# Altium schematic sheet Power.SchDoc
size A4; SheetNumber: 1; SheetTotal: 2
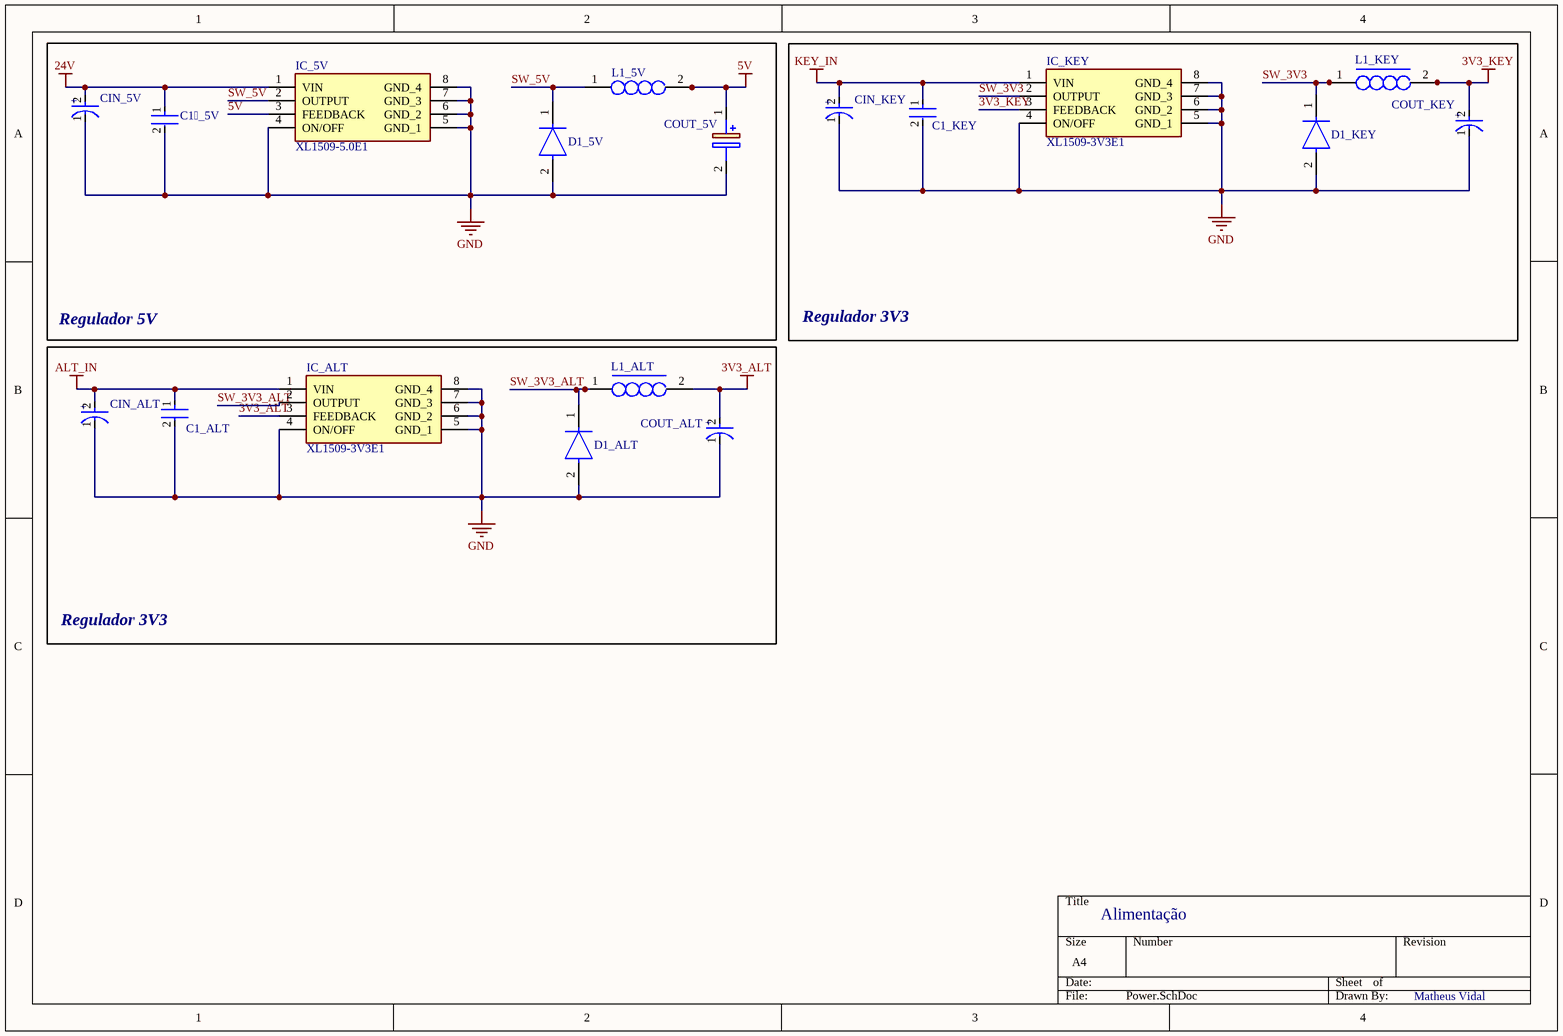
[diagram p0: Power.SchDoc]

## Parts
C1__5V  08055C105KAT2A  [FP-0805-L_2_01_0_2-W_1_25-MFG]  (value not drawn)
C1_ALT  08055C105KAT2A  [FP-0805-L_2_01_0_2-W_1_25-MFG]  (value not drawn)
C1_KEY  08055C105KAT2A  [FP-0805-L_2_01_0_2-W_1_25-MFG]  (value not drawn)
CIN_5V  EEEFK1V471SP  [FP-FKSG-MFG]  (value not drawn)
CIN_ALT  EEEFK1V471SP  [FP-FKSG-MFG]  (value not drawn)
CIN_KEY  EEEFK1V471SP  [FP-FKSG-MFG]  (value not drawn)
COUT_5V  B40900B7277M000  [CAPAE1030X1050N]  (value not drawn)
COUT_ALT  MAL215099001E3  [FP-MAL2150-1010-MFG]  (value not drawn)
COUT_KEY  MAL215099001E3  [FP-MAL2150-1010-MFG]  (value not drawn)
D1_5V  1N5819HW1-7-F  [FP-SOD123F_Type_B-MFG]  (value not drawn)
D1_ALT  1N5819HW1-7-F  [FP-SOD123F_Type_B-MFG]  (value not drawn)
D1_KEY  1N5819HW1-7-F  [FP-SOD123F_Type_B-MFG]  (value not drawn)
IC_5V  XL1509-5.0E1  [SOIC127P600X175-8N]
IC_ALT  XL1509-3V3E1  [SOIC127P600X175-8N]
IC_KEY  XL1509-3V3E1  [SOIC127P600X175-8N]
L1_5V  SRR1260-680M  [INDPM125125X650N]  (value not drawn)
L1_ALT  SPM6545VT-470M-D  [SPM6545VT]  (value not drawn)
L1_KEY  SPM6545VT-470M-D  [SPM6545VT]  (value not drawn)

## Blocks framed on the sheet
Regulador 5V: C1__5V CIN_5V COUT_5V D1_5V IC_5V L1_5V
Regulador 3V3: C1_KEY CIN_KEY COUT_KEY D1_KEY IC_KEY L1_KEY

## Nets
3V3_ALT: COUT_ALT.2(A) IC_ALT.3(FEEDBACK) L1_ALT.2
3V3_KEY: COUT_KEY.2(A) IC_KEY.3(FEEDBACK) L1_KEY.2
5V: COUT_5V.1(+) IC_5V.3(FEEDBACK) L1_5V.2
24V: C1__5V.1 CIN_5V.2(A) IC_5V.1(VIN)
ALT_IN: C1_ALT.1 CIN_ALT.2(A) IC_ALT.1(VIN)
GND: C1__5V.2 C1_ALT.2 C1_KEY.2 CIN_5V.1(C) CIN_ALT.1(C) CIN_KEY.1(C) COUT_5V.2(-) COUT_ALT.1(C) COUT_KEY.1(C) D1_5V.2(A) D1_ALT.2(A) D1_KEY.2(A) IC_5V.4(ON/OFF) IC_5V.5(GND_1) IC_5V.6(GND_2) IC_5V.7(GND_3) IC_5V.8(GND_4) IC_ALT.4(ON/OFF) IC_ALT.5(GND_1) IC_ALT.6(GND_2) IC_ALT.7(GND_3) IC_ALT.8(GND_4) IC_KEY.4(ON/OFF) IC_KEY.5(GND_1) IC_KEY.6(GND_2) IC_KEY.7(GND_3) IC_KEY.8(GND_4)
KEY_IN: C1_KEY.1 CIN_KEY.2(A) IC_KEY.1(VIN)
SW_3V3: D1_KEY.1(C) IC_KEY.2(OUTPUT) L1_KEY.1
SW_3V3_ALT: D1_ALT.1(C) IC_ALT.2(OUTPUT) L1_ALT.1
SW_5V: D1_5V.1(C) IC_5V.2(OUTPUT) L1_5V.1

## Notes on the sheet
- Regulador 3V3
- Alimentação
- Matheus Vidal
- (in symbol CMP-00030-44434444-1) +
- (in symbol CMP-05427-000037-1) +

## Library data of the parts
C1__5V C1_ALT C1_KEY = CMP-2007-04696-2: General Purpose Ceramic Capacitor, 0805, 1uF, 10%, X7R, 15%, 50V; Dissipation Factor: 2.5%; Packaging: Tape and Reel; Lead Free: Lead Free; Contact Plating: Tin; Dielectric: X7R; Tolerance: 10%; Capacitance: 1uF; REACH SVHC: No SVHC; Voltage Rating (DC): 50V; Depth: 1.25mm; Voltage Rating: 50V; Radiation Hardening: No; Case Code (Metric): 2012; Width: 0.049inch; Package Quantity: 1; Mount: Surface Mount; Length: 2.01mm; Series: -; Thickness: 0.037inch; Max Operating Temperature: 125°C; RoHS Compliant: Yes; Termination: SMD/SMT; Case/Package: 0805; Min Operating Temperature: -55°C; Voltage: 50V; Case Code (Imperial): 0805
CIN_5V CIN_ALT CIN_KEY = CMP-05427-000037-1: CAP ALUM 470UF 20% 35V SMD; Ripple Current: 552.5mA; Life (Hours): 2000Hour; ESR (Equivalent Series Resistance): 80mR; Ripple Current (AC): 850mA; Polarity: Polar; Max Operating Temperature: 105°C; Height - Seated (Max): 0.413inch; Height: 10.2mm; Min Operating Temperature: -55°C; Voltage Rating: 35V; Voltage Rating (DC): 35V; Package Quantity: 500; Packaging: Cut Tape; Tolerance: 20%; Capacitance: 470uF; RoHS Compliant: Yes; Mount: Surface Mount; Case/Package: Radial; Diameter: 10mm
COUT_5V = B40900B7277M000: Capacitor Polarised; Manufacturer_Name: TDK; Datasheet Link: https://product.tdk.com/system/files/dam/doc/product/capacitor/aluminum-electrolytic/hybrid-polymer/data_sheet/20/30/db/aec/b40900.pdf; Height: 10.5mm; Manufacturer_Part_Number: B40900B7277M000; Mouser Part Number: 871-B40900B7277M000; Mouser Price/Stock: https://www.mouser.co.uk/ProductDetail/EPCOS-TDK/B40900B7277M000?qs=P1JMDcb91o5CBLRrUxE0Gw%3D%3D
COUT_ALT COUT_KEY = CMP-00030-44434444-1: MAL215099001E3 Aluminum Electrolytic Capacitor, 220 uF, 35 V, ± 20%, 2000 hours @ 105°C, Radial Can - SMD; Voltage Rating: 35V; Polarity: Polar; Impedance: 150mΩ; Ripple Current: 630mA; Life (Hours): 2500hours; Capacitance: 220µF; Height - Seated (Max): 10.4902mm; Packaging: Digi-Reel®; Radiation Hardening: No; Case/Package: Radial; Mount: Surface Mount; Schedule B: 8532220020, 8532220020; Voltage Rating (DC): 35V; Diameter: 10mm; Height: 10mm; RoHS: Compliant; Tolerance: 20%; NexarPartId: 44434444; Min Operating Temperature: -55°C; Max Operating Temperature: 105°C; REACH SVHC: Unknown; Ripple Current (AC): 630mA
D1_5V D1_ALT D1_KEY = CMP-12791-000028-1: DIODE SBR 40V 1A SOD123F; Manufacturer: Diodes Inc.; Max Junction Temp: +125°C; Capacitance: 30pF; Value: 30pF; Peak Reverse Current: 0.5mA; Max Surge Forward Current: 30A; ComponentLink2Description: Datasheet; Temperature: -55°C to +125°C; Lead Free: Yes; Package: SOD123F (Type B); Reverse Voltage: 40V; Device Class L2: Diodes; Manufacturer Part Number: 1N5819HW1-7-F; ComponentLink2URL: https://www.diodes.com/assets/Datasheets/1N5819HW1.pdf; Automotive: No; RoHS: TRUE; Height: 1.15mm; Digikey Description: DIODE SBR 40V 1A SOD123F; Max Repetitive Reverse Voltage: 40V; Forward Current: 1A; Footprint Url: https://www.diodes.com/assets/Package-Files/SOD123F%20(Type%20B).pdf; Temperature Range High: +125°C; Octopart: https://octopart.com/1n5819hw1-7-f-diodes+inc.-67250096; Mouser Description: Schottky Diodes & Rectifiers 1A SBR 40Vrrm 0.51Vf 0.5mA 28Vrms; Device Class L3: Rectifier Diodes; Ipc Land Pattern Name: SOD350180X98-2; Device Class L1: Discrete Semiconductors; Category: Diode; Temperature Range Low: -55°C
IC_5V IC_ALT IC_KEY = XL1509-5.0E1: Integrated Circuit; Manufacturer_Name: XLSEMI; Datasheet Link: https://datasheet.lcsc.com/szlcsc/XLSEMI-XL1509-5-0E1_C61063.pdf; Height: 1.75mm; Manufacturer_Part_Number: XL1509-5.0E1
L1_5V = SRR1260-680M: Inductor; Manufacturer_Name: Bourns; Datasheet Link: https://componentsearchengine.com/Datasheets/2/SRR1260-680M.pdf; Height: 6.5mm; Manufacturer_Part_Number: SRR1260-680M; Mouser Part Number: 652-SRR1260-680M; Mouser Price/Stock: https://www.mouser.co.uk/ProductDetail/Bourns/SRR1260-680M?qs=meVWcSOgEr6IqR5KoVnPsw%3D%3D; Arrow Part Number: SRR1260-680M; Arrow Price/Stock: https://www.arrow.com/en/products/srr1260-680m/bourns?utm_currency=USD&region=nac
L1_ALT L1_KEY = SPM6545VT-470M-D: Inductor (FeSi Core); Manufacturer_Name: TDK; Datasheet Link: https://product.tdk.com/system/files/dam/doc/product/inductor/inductor/smd/catalog/inductor_automotive_power_spm6545vt-d_en.pdf; Manufacturer_Part_Number: SPM6545VT-470M-D; Mouser Part Number: 810-SPM6545VT-470M-D; Mouser Price/Stock: https://www.mouser.co.uk/ProductDetail/TDK/SPM6545VT-470M-D?qs=vmHwEFxEFR%2FaEnepn6nn%2Fw%3D%3D; Arrow Part Number: SPM6545VT-470M-D; Arrow Price/Stock: https://www.arrow.com/en/products/spm6545vt-470m-d/tdk?region=nac